# EAGLE schematic PCI_Aviario (EAGLE 7.7.0)
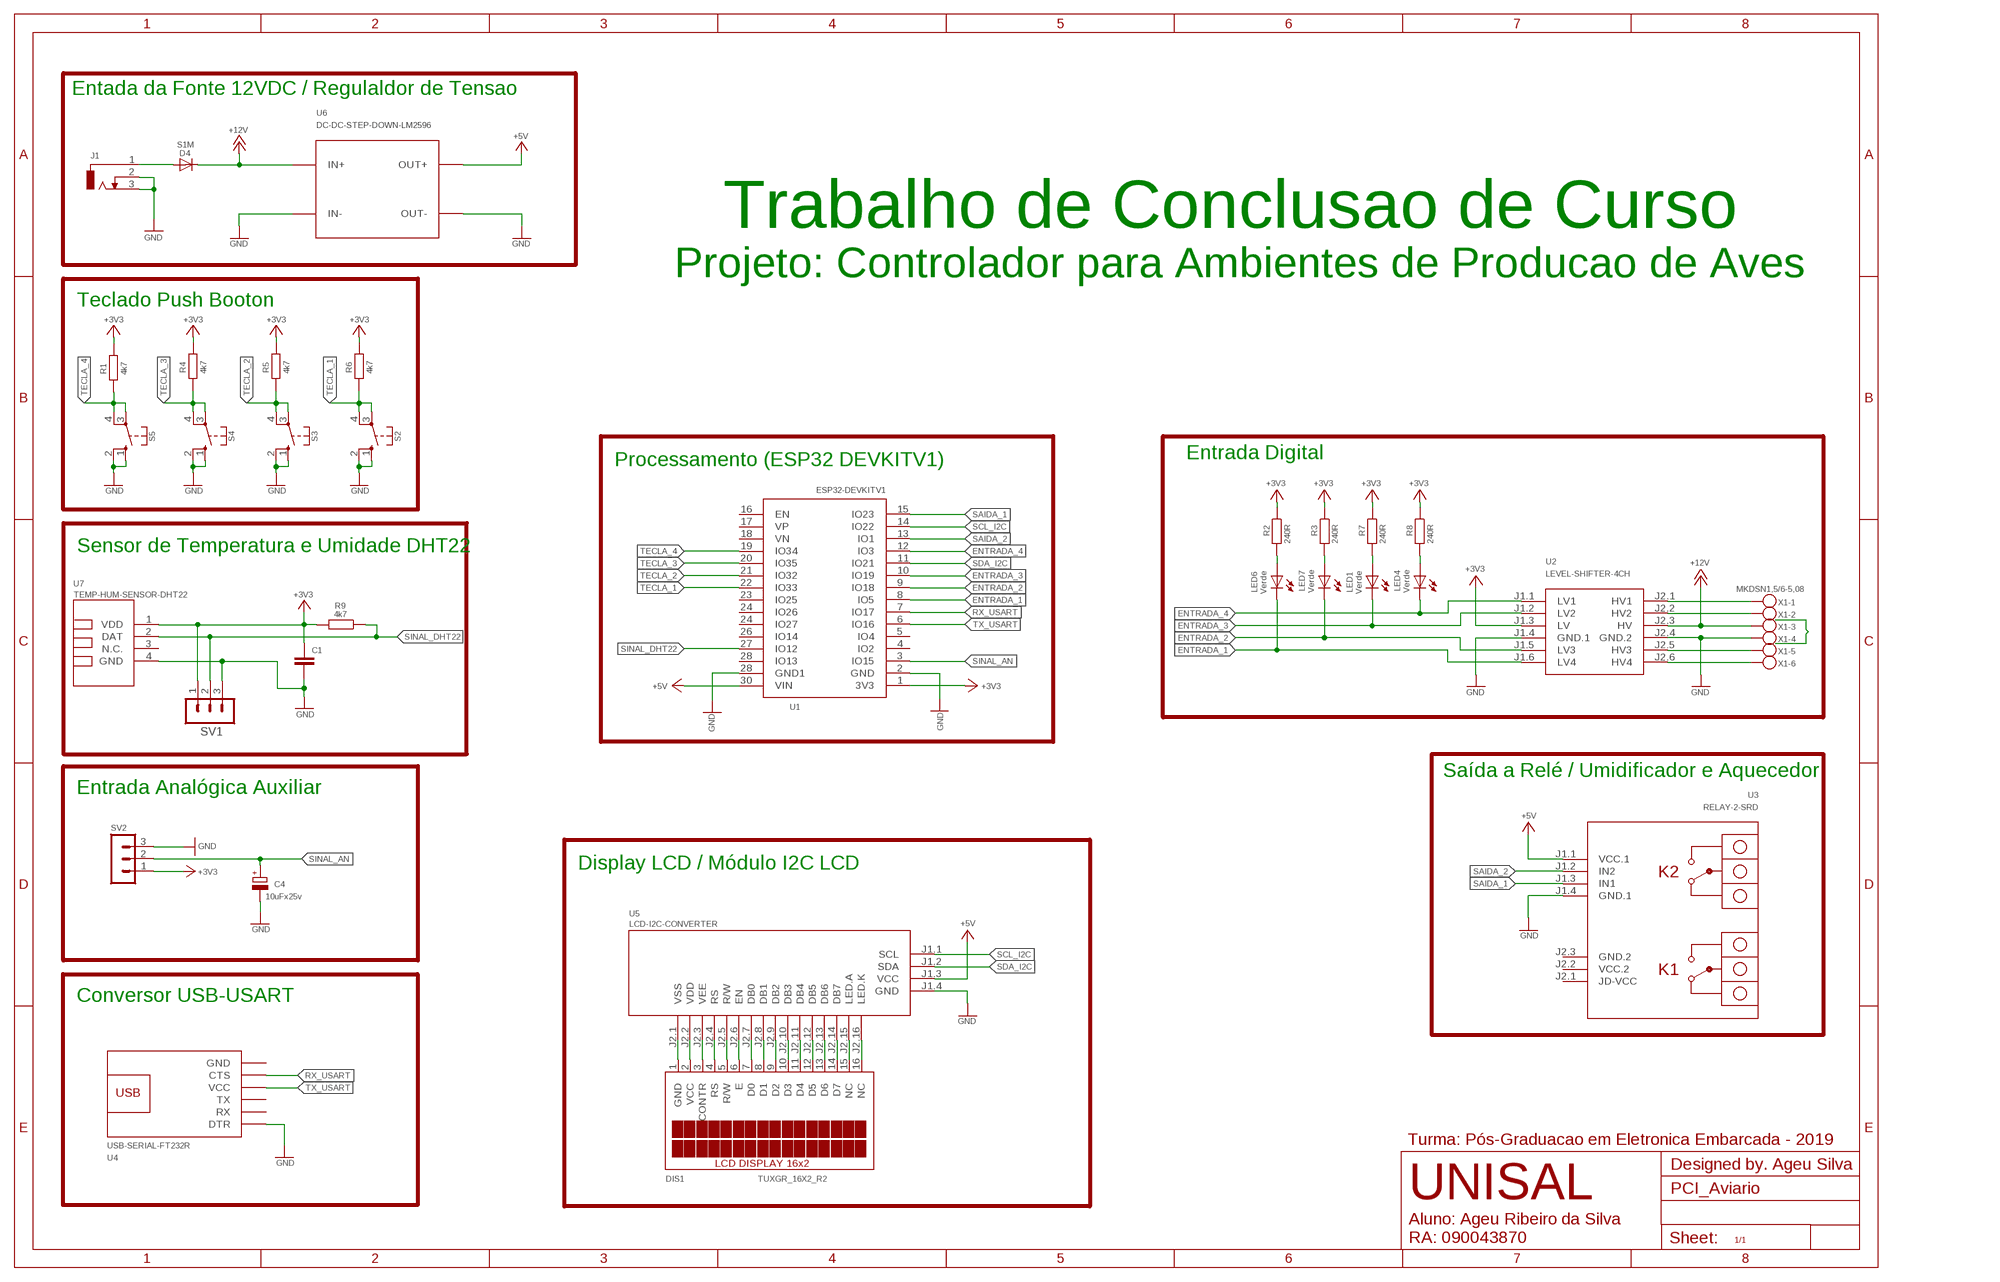
[diagram p0: schematic, sheet 1]

## Parts
C1  C-EU025-030X050  [C025-030X050]
C4  10uFx25v  CPOL-EUE2.5-5  [E2,5-5]
D4  S1M  1N5624  [DO201-15]
DIS1  TUXGR_16X2_R2  [TUXGR_16X2_R2]
J1  DCJ0303  [DCJ0303]
LED1  Verde  LED3MM  [LED3MM]
LED4  Verde  LED3MM  [LED3MM]
LED6  Verde  LED3MM  [LED3MM]
LED7  Verde  LED3MM  [LED3MM]
R1  4k7  R-EU_0207/10  [0207/10]
R2  240R  R-EU_0207/10  [0207/10]
R3  240R  R-EU_0207/10  [0207/10]
R4  4k7  R-EU_0207/10  [0207/10]
R5  4k7  R-EU_0207/10  [0207/10]
R6  4k7  R-EU_0207/10  [0207/10]
R7  240R  R-EU_0207/10  [0207/10]
R8  240R  R-EU_0207/10  [0207/10]
R9  4k7  R-EU_0207/10  [0207/10]
S2  10-XX  [B3F-10XX]
S3  10-XX  [B3F-10XX]
S4  10-XX  [B3F-10XX]
S5  10-XX  [B3F-10XX]
SV1  MA03-1  [MA03-1]
SV2  MA03-1  [MA03-1]
U1  ESP32DEVKITV1  [ESP32-DEVKITV1]
U2  LEVEL-SHIFTER-4CH  [LEVEL-SHIFTER-4CH]
U3  RELAY-2-SRD  [RELAY-2-SRD]
U4  USB-SERIAL-FT232R  [USB-SERIAL-FT232R]
U5  LCD-I2C-CONVERTER  [LCD-I2C-CONVERTER]
U6  DC-DC-STEP-DOWN-LM2596  [DC-DC-STEP-DOWN-LM2596]
U7  TEMP-HUM-SENSOR-DHT22  [TEMP-HUM-SENSOR-DHT22]
X1  MKDSN1,5/6-5,08  [MKDSN1,5/6-5,08]

## Nets
+3V3: C1.1 R1.2 R2.1 R3.1 R4.2 R5.2 R6.2 R7.1 R8.1 R9.2 SV1.1 SV2.1 U1.1(3V3) U2.J1.3(LV) U7.1(VDD)
+5V: U1.30(VIN) U3.J1.1(VCC.1) U5.J1.3(VCC) U6.OUT+
+12V: D4.C U2.J2.3(HV) U6.IN+ X1.3
ENTRADA_1: LED6.K(C) U1.8(IO5) U2.J1.6(LV4)
ENTRADA_2: LED7.K(C) U1.9(IO18) U2.J1.5(LV3)
ENTRADA_3: LED1.K(C) U1.10(IO19) U2.J1.2(LV2)
ENTRADA_4: LED4.K(C) U1.12(IO3) U2.J1.1(LV1)
GND: C1.2 C4.- J1.2 J1.3 S2.1(S) S2.2(S1) S3.1(S) S3.2(S1) S4.1(S) S4.2(S1) S5.1(S) S5.2(S1) SV1.3 SV2.3 U1.2(GND) U1.28(GND1) U2.J1.4(GND.1) U2.J2.4(GND.2) U3.J1.4(GND.1) U4.1(DTR) U5.J1.4(GND) U6.IN- U6.OUT- U7.4(GND) X1.4
N$1: DIS1.1(GND) U5.J2.1(VSS)
N$2: DIS1.2(VCC) U5.J2.2(VDD)
N$3: DIS1.3(CONTR) U5.J2.3(VEE)
N$4: DIS1.4(RS) U5.J2.4(RS)
N$5: DIS1.5(R/W) U5.J2.5(R/W)
N$6: DIS1.6(E) U5.J2.6(EN)
N$7: LED1.A R7.2
N$8: DIS1.7(D0) U5.J2.7(DB0)
N$9: DIS1.8(D1) U5.J2.8(DB1)
N$10: LED4.A R8.2
N$11: U2.J2.2(HV2) X1.2
N$12: DIS1.9(D2) U5.J2.9(DB2)
N$13: U2.J2.1(HV1) X1.1
N$14: DIS1.10(D3) U5.J2.10(DB3)
N$15: DIS1.11(D4) U5.J2.11(DB4)
N$16: DIS1.12(D5) U5.J2.12(DB5)
N$17: DIS1.13(D6) U5.J2.13(DB6)
N$18: DIS1.14(D7) U5.J2.14(DB7)
N$19: U2.J2.5(HV3) X1.5
N$20: U2.J2.6(HV4) X1.6
N$21: DIS1.15(NC) U5.J2.15(LED.A)
N$22: DIS1.16(NC) U5.J2.16(LED.K)
N$28: D4.A J1.1
N$45: LED6.A R2.2
N$48: LED7.A R3.2
RX_USART: U1.7(IO17) U4.5(CTS)
SAIDA_1: U1.15(IO23) U3.J1.3(IN1)
SAIDA_2: U1.13(IO1) U3.J1.2(IN2)
SCL_I2C: U1.14(IO22) U5.J1.1(SCL)
SDA_I2C: U1.11(IO21) U5.J1.2(SDA)
SINAL_AN: C4.+ SV2.2 U1.3(IO15)
SINAL_DHT22: R9.1 SV1.2 U1.27(IO12) U7.2(DAT)
TECLA_1: R6.1 S2.3(P) S2.4(P1) U1.22(IO33)
TECLA_2: R5.1 S3.3(P) S3.4(P1) U1.21(IO32)
TECLA_3: R4.1 S4.3(P) S4.4(P1) U1.20(IO35)
TECLA_4: R1.1 S5.3(P) S5.4(P1) U1.19(IO34)
TX_USART: U1.6(IO16) U4.4(VCC)
Unconnected: U1.4(IO2) U1.5(IO4) U1.16(EN) U1.17(VP) U1.18(VN) U1.23(IO25) U1.24(IO26) U1.24(IO27) U1.26(IO14) U1.28(IO13) U3.J2.1(JD-VCC) U4.2(RX) U4.3(TX) U4.6(GND) U7.3(N.C.)

## Notes on the sheet
- Entada da Fonte 12VDC / Regulaldor de Tensao
- Trabalho de Conclusao de Curso
- Projeto: Controlador para Ambientes de Producao de Aves
- Teclado Push Booton
- Entrada Digital
- Processamento (ESP32 DEVKITV1)
- Sensor de Temperatura e Umidade DHT22
- Saída a Relé / Umidificador e Aquecedor
- Entrada Analógica Auxiliar
- Display LCD / Módulo I2C LCD
- Conversor USB-USART
- Turma: Pós-Graduacao em Eletronica Embarcada - 2019
- Designed by. Ageu Silva
- UNISAL
- Aluno: Ageu Ribeiro da Silva
  RA: 090043870

## Power pins joined to a net without a drawn wire
GND.2: U3.J2.3(GND.2)
VCC.2: U3.J2.2(VCC.2)

## Library data of the parts
C1 = rcl:C-EU: CAPACITOR, European symbol
C4 = rcl:CPOL-EU: POLARIZED CAPACITOR, European symbol
D4 = diode:1N5624: DIODE controlled avalanche rectifier
DIS1 = display-lcd:TUXGR_16X2_R2: Tuxgraphics LCD display 16x2 characters reflective, without background light Source: tuxgr_12x2_r2.pdf; OC_FARNELL: unknown; OC_NEWARK: unknown
J1 = con-jack:DCJ0303: DC POWER JACK Source: DCJ0303.pdf; OC_FARNELL: unknown; OC_NEWARK: unknown
LED1 LED4 LED6 LED7 = led:LED: LED OSRAM: - CHIPLED LG R971, LG N971, LY N971, LG Q971, LY Q971, LO R971, LY R971 LH N974, LH R974 LS Q976, LO Q976, LY Q976 LO Q996 - Hyper CHIPLED LW Q18S LB Q993, LB Q99A, LB R99A - SideLED LS A670, LO A670, LY A670, LG A670, LP A670 LB A673, LV A673, LT A673, LW A673 LH A674 LY A675 LS A676, LA A676, LO A676, LY A676, LW A676 LS A679, LY A679, LG A679 - Hyper Micro SIDELED® LS Y876, LA Y876, LO Y876, LY Y876 LT Y87S - SmartLED LW L88C, LW L88S LB L89C, LB L89S, LG L890 LS L89K, LO L89K, LY L89K LS L896, LA L896, LO L896, LY L896 - TOPLED LS T670, LO T670, LY T670, LG T670, LP T670 LSG T670, LSP T670, LSY T670, LOP T670, LYG T670 LG T671, LOG T671, LSG T671 LB T673, LV T673, LT T673, LW T673 LH T674 LS T676, LA T676, LO T676, LY T676, LB T676, LH T676, LSB T676, LW T676 LB T67C, LV T67C, LT T67C, LS T67K, LO T67K, LY T67K, LW E67C LS E67B, LA E67B, LO E67B, LY E67B, LB E67C, LV E67C, LT E67C LW T67C LS T679, LY T679, LG T679 LS T770, LO T770, LY T770, LG T770, LP T770 LB T773, LV T773, LT T773, LW T773 LH T774 LS E675, LA E675, LY E675, LS T675 LS T776, LA T776, LO T776, LY T776, LB T776 LHGB T686 LT T68C, LB T68C - Hyper Mini TOPLED® LB M676 - Mini TOPLED Santana® LG M470 LS M47K, LO M47K, LY M47K Source: http://www.osram.convergy.de LUXEON: - LUMILED® LXK2-PW12-R00, LXK2-PW12-S00, LXK2-PW14-U00, LXK2-PW14-V00 LXK2-PM12-R00, LXK2-PM12-S00, LXK2-PM14-U00 LXK2-PE12-Q00, LXK2-PE12-R00, LXK2-PE12-S00, LXK2-PE14-T00, LXK2-PE14-U00 LXK2-PB12-K00, LXK2-PB12-L00, LXK2-PB12-M00, LXK2-PB14-N00, LXK2-PB14-P00, LXK2-PB14-Q00 LXK2-PR12-L00, LXK2-PR12-M00, LXK2-PR14-Q00, LXK2-PR14-R00 LXK2-PD12-Q00, LXK2-PD12-R00, LXK2-PD12-S00 LXK2-PH12-R00, LXK2-PH12-S00 LXK2-PL12-P00, LXK2-PL12-Q00, LXK2-PL12-R00 Source: www.luxeon.com KINGBRIGHT: KA-3528ASYC Source: www.kingbright.com
R1-R9 = rcl:R-EU_: RESISTOR, European symbol
S2-S5 = switch-omron:10-XX: OMRON SWITCH; MPN: B3F-1000; OC_FARNELL: 176432; OC_NEWARK: 36M3542
SV1 SV2 = con-lstb:MA03-1: PIN HEADER; OC_FARNELL: unknown; OC_NEWARK: unknown
U1 = ESP32-DEVKITV1:ESP32DEVKITV1
U2 = diy-modules:LEVEL-SHIFTER-4CH: 4-Channel Bi-Directional Logic Level Converter based on BSS128 transistors Click here to find device on ebay.com <http://www.ebay.com/sch/i2c+logic+converter+module>
U3 = diy-modules:RELAY-2-SRD: 2-Channel Relay Module based on SRD-05VDC-SL-C relays Click here to find device on ebay.com <http://www.ebay.com/sch/two+channel+relay+module+optocoupler+5v>
U4 = diy-modules:USB-SERIAL-FT232R: USB to Serial UART Converter based on FT232R chip More information about FT232R chip is available here: http://www.ftdichip.com/Products/ICs/FT232R.htm Click here to find device on ebay.com <http://www.ebay.com/sch/ft232rl+arduino+download+max232>
U5 = diy-modules:LCD-I2C-CONVERTER: I2C Bus to 4-Bit Parallel LCD Interface with LED backlight driver
U6 = diy-modules:DC-DC-STEP-DOWN-LM2596: DC/DC Step-Down Regulator based on LM2596-ADJ chip LM2596 datasheet available here: http://www.ti.com/lit/ds/symlink/lm2596.pdf Click here to find device on ebay.com <http://www.ebay.com/sch/lm2596+power+regulator>
U7 = diy-modules:TEMP-HUM-SENSOR-DHT22: DHT22 - digital humidity & temperature sensor Also known as: AM2302 AM2302 datasheet available here: http://akizukidenshi.com/download/ds/aosong/AM2302.pdf Click here to find device on ebay.com <http://www.ebay.com/sch/dht22+digital+sensor>
X1 = con-phoenix-508:MKDSN1,5/6-5,08: MKDSN 1,5/ 6-5,08 Printklemme Nennstrom: 13,5 A Nennspannung: 250 V Rastermaß: 5,08 mm Polzahl: 6 Anschlussart: Schraubanschluss Montage: Löten Anschlussrichtung Leiter/Platine: 0 ° Artikelnummer: 1729160 Source: http://eshop.phoenixcontact.com .. 1729160.pdf